# Altium schematic sheet front_sensor.SchDoc
size A4
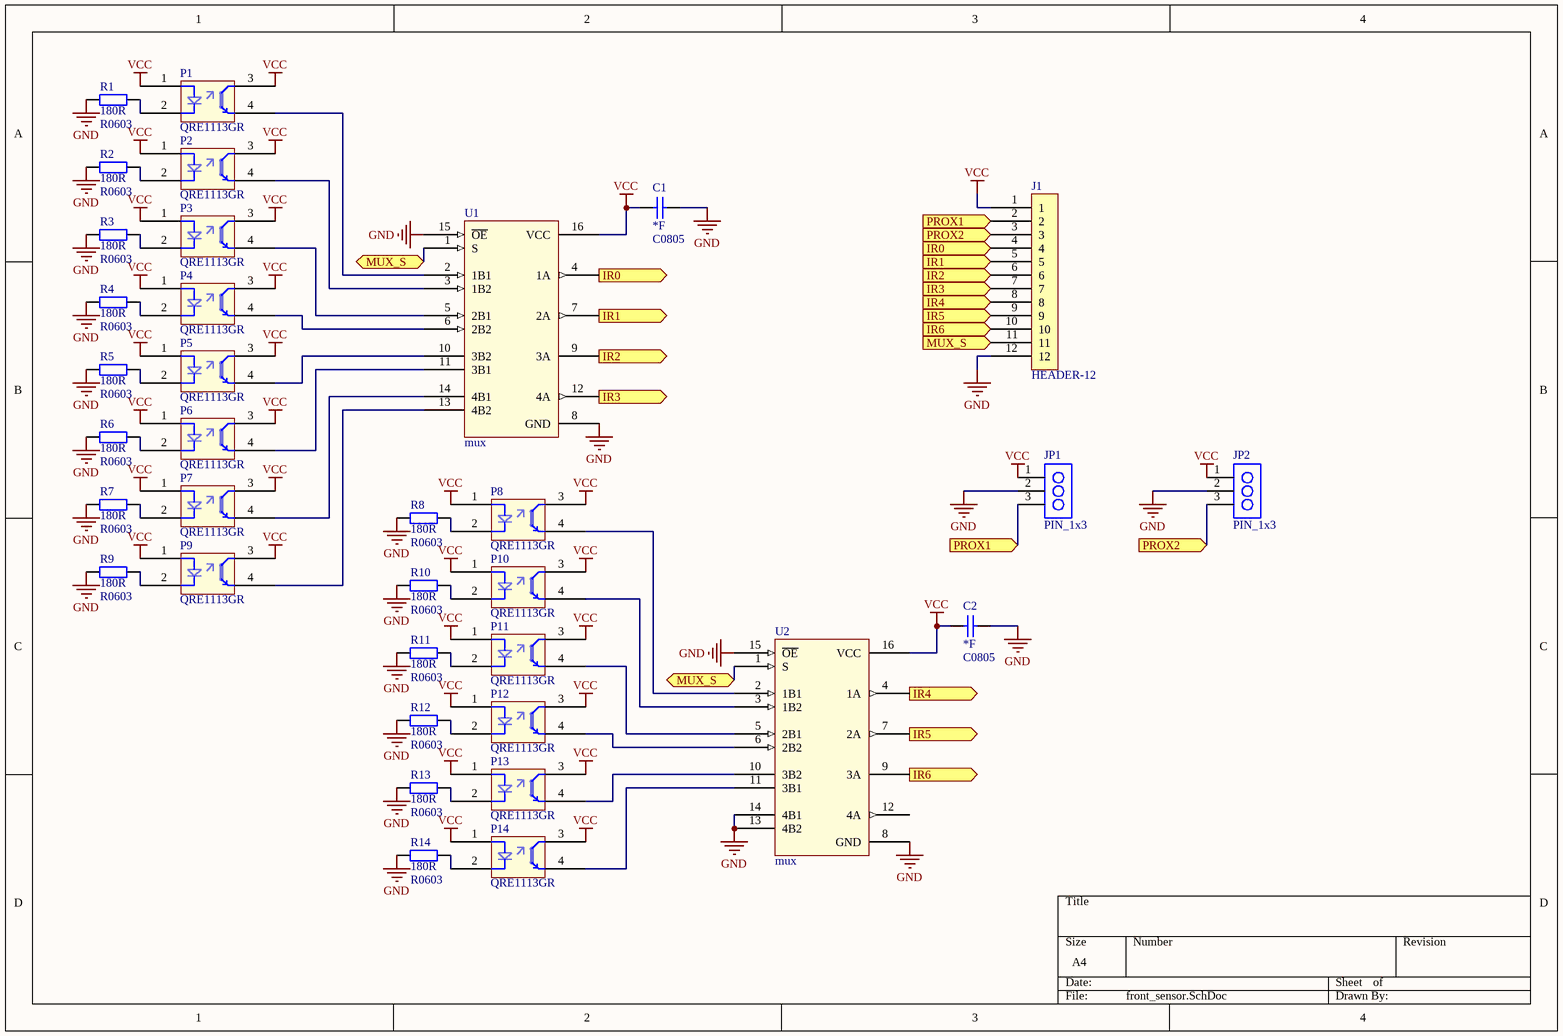
[diagram p0: front_sensor.SchDoc]

## Parts
C1  Capacitance: *F  [C0805]
C2  Capacitance: *F  [C0805]
J1  HEADER-12  [MICRO-MATCH-12]
JP1  PIN_1x3  [2.54_1X3H]
JP2  PIN_1x3  [2.54_1X3H]
P1  QRE1113GR  [QRE1113GR]
P2  QRE1113GR  [QRE1113GR]
P3  QRE1113GR  [QRE1113GR]
P4  QRE1113GR  [QRE1113GR]
P5  QRE1113GR  [QRE1113GR]
P6  QRE1113GR  [QRE1113GR]
P7  QRE1113GR  [QRE1113GR]
P8  QRE1113GR  [QRE1113GR]
P9  QRE1113GR  [QRE1113GR]
P10  QRE1113GR  [QRE1113GR]
P11  QRE1113GR  [QRE1113GR]
P12  QRE1113GR  [QRE1113GR]
P13  QRE1113GR  [QRE1113GR]
P14  QRE1113GR  [QRE1113GR]
R1  180R  [R0603]
R2  180R  [R0603]
R3  180R  [R0603]
R4  180R  [R0603]
R5  180R  [R0603]
R6  180R  [R0603]
R7  180R  [R0603]
R8  180R  [R0603]
R9  180R  [R0603]
R10  180R  [R0603]
R11  180R  [R0603]
R12  180R  [R0603]
R13  180R  [R0603]
R14  180R  [R0603]
U1  mux  [TSOP65P650X110-16N]
U2  mux  [TSOP65P650X110-16N]

## Ports
IR0, IR1, IR2, IR3, IR4, IR5, IR6, MUX_S, PROX1, PROX2

## Nets
GND: C1.1 C2.1 J1.12 JP1.2 JP2.2 R1.2 R2.2 R3.2 R4.2 R5.2 R6.2 R7.2 R8.2 R9.2 R10.2 R11.2 R12.2 R13.2 R14.2 U1.8(GND) U1.15(~{OE}) U2.8(GND) U2.13(4B2) U2.14(4B1) U2.15(~{OE})
VCC: C1.2 C2.2 J1.1 JP1.1 JP2.1 P1.1(Anode) P1.3(Collector) P2.1(Anode) P2.3(Collector) P3.1(Anode) P3.3(Collector) P4.1(Anode) P4.3(Collector) P5.1(Anode) P5.3(Collector) P6.1(Anode) P6.3(Collector) P7.1(Anode) P7.3(Collector) P8.1(Anode) P8.3(Collector) P9.1(Anode) P9.3(Collector) P10.1(Anode) P10.3(Collector) P11.1(Anode) P11.3(Collector) P12.1(Anode) P12.3(Collector) P13.1(Anode) P13.3(Collector) P14.1(Anode) P14.3(Collector) U1.16(VCC) U2.16(VCC)
IR0: J1.4 U1.4(1A) ; port IR0
IR1: J1.5 U1.7(2A) ; port IR1
IR2: J1.6 U1.9(3A) ; port IR2
IR3: J1.7 U1.12(4A) ; port IR3
IR4: J1.8 U2.4(1A) ; port IR4
IR5: J1.9 U2.7(2A) ; port IR5
IR6: J1.10 U2.9(3A) ; port IR6
MUX_S: J1.11 U1.1(S) U2.1(S) ; port MUX_S
PROX1: J1.2 JP1.3 ; port PROX1
PROX2: J1.3 JP2.3 ; port PROX2
NetP1_2: P1.2(cathode) R1.1
NetP1_4: P1.4(Emitter) U1.2(1B1)
NetP2_2: P2.2(cathode) R2.1
NetP2_4: P2.4(Emitter) U1.3(1B2)
NetP3_2: P3.2(cathode) R3.1
NetP3_4: P3.4(Emitter) U1.5(2B1)
NetP4_2: P4.2(cathode) R4.1
NetP4_4: P4.4(Emitter) U1.6(2B2)
NetP5_2: P5.2(cathode) R5.1
NetP5_4: P5.4(Emitter) U1.10(3B2)
NetP6_2: P6.2(cathode) R6.1
NetP6_4: P6.4(Emitter) U1.11(3B1)
NetP7_2: P7.2(cathode) R7.1
NetP7_4: P7.4(Emitter) U1.14(4B1)
NetP8_2: P8.2(cathode) R8.1
NetP8_4: P8.4(Emitter) U2.2(1B1)
NetP9_2: P9.2(cathode) R9.1
NetP9_4: P9.4(Emitter) U1.13(4B2)
NetP10_2: P10.2(cathode) R10.1
NetP10_4: P10.4(Emitter) U2.3(1B2)
NetP11_2: P11.2(cathode) R11.1
NetP11_4: P11.4(Emitter) U2.5(2B1)
NetP12_2: P12.2(cathode) R12.1
NetP12_4: P12.4(Emitter) U2.6(2B2)
NetP13_2: P13.2(cathode) R13.1
NetP13_4: P13.4(Emitter) U2.10(3B2)
NetP14_2: P14.2(cathode) R14.1
NetP14_4: P14.4(Emitter) U2.11(3B1)

Not connected (* = marked no-connect by the designer): U2 12(4A)

## Library data of the parts
C1 C2 = Capacitor: Ceramic capacitor; Type: MLCC; Voltage rating: *V; ComponentLinknDescription: Datasheet; Characteristic: *; Manufacturer: *; ComponentLinknURL: *; Note: C0805
P1-P14 = QRE1113GR: Reflective Photo Interrupter
R1-R14 = Resistor: Precision: *%; Voltage rating: *V; Temp coefficient: *ppm; Power rating: *mW; ComponentLinknDescription: Datasheet; Manufacturer: *; ComponentLinknURL: *; Resistance: 180R; Note: R0603
U1 U2 = FSAL200: Analog mux
JP1 JP2 = PIN_1x3: Manufacturer: *; Part Number: *; ComponentLinknDescription: *; ComponentLinknURL: *; Drawn By: Erik Ilbis